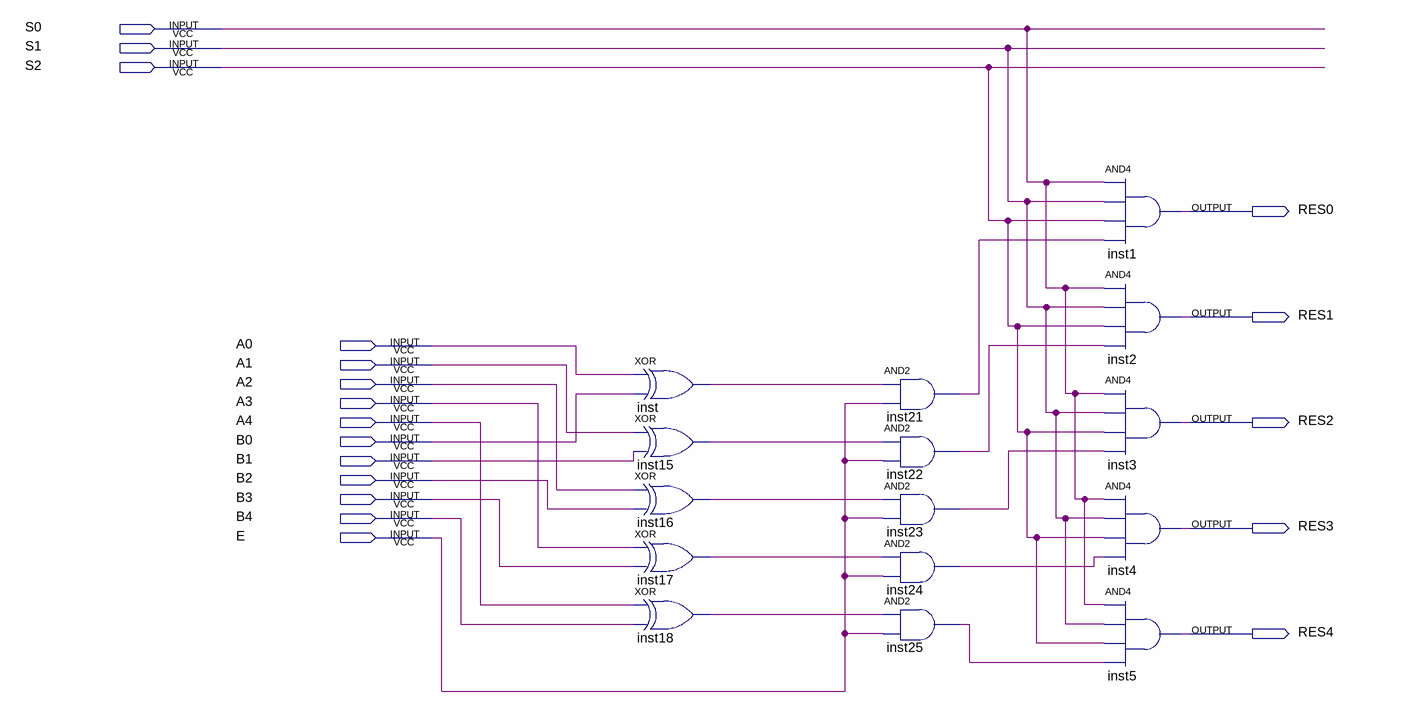
[diagram p0: schematic sheet]
// Quartus schematic MUX_XOR.bdf as structural Verilog: 15 symbols, 19 pins
module MUX_XOR (
  input  S0,
  input  S1,
  input  S2,
  input  A0,
  input  A1,
  input  A2,
  input  A3,
  input  A4,
  input  B0,
  input  B1,
  input  B2,
  input  B3,
  input  B4,
  input  E,
  output RES0,
  output RES1,
  output RES2,
  output RES3,
  output RES4
);

  wire inst15_out, inst16_out, inst17_out, inst18_out, inst21_out, inst22_out, inst23_out, inst24_out,
       inst25_out, inst_out;

  xor inst (inst_out, A0, B0);
  xor inst15 (inst15_out, A1, B1);
  xor inst16 (inst16_out, A2, B2);
  xor inst17 (inst17_out, A3, B3);
  xor inst18 (inst18_out, A4, B4);
  and inst21 (inst21_out, inst_out, E);
  and inst22 (inst22_out, inst15_out, E);
  and inst23 (inst23_out, inst16_out, E);
  and inst24 (inst24_out, inst17_out, E);
  and inst25 (inst25_out, inst18_out, E);
  and inst1 (RES0, S0, S1, S2, inst21_out);
  and inst2 (RES1, S0, S1, S2, inst22_out);
  and inst3 (RES2, S0, S1, S2, inst23_out);
  and inst4 (RES3, S0, S1, S2, inst24_out);
  and inst5 (RES4, S0, S1, S2, inst25_out);
endmodule
